# EAGLE design line_sensor_ver1.1 (EAGLE 6.2)
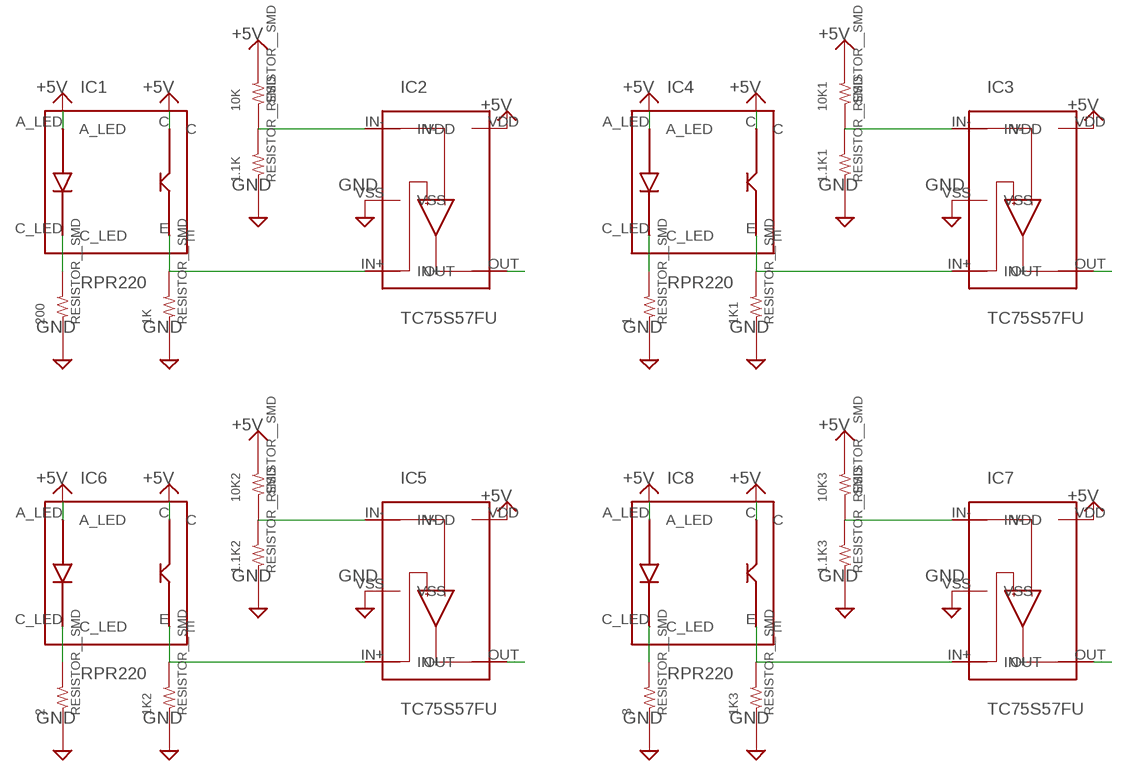
[diagram p0: schematic, sheet 1]

## Parts
1  RESISTOR__SMD  [1608]
1.1K  RESISTOR__SMD  [1608]
1.1K1  RESISTOR__SMD  [1608]
1.1K2  RESISTOR__SMD  [1608]
1.1K3  RESISTOR__SMD  [1608]
1K  RESISTOR__SMD  [1608]
1K1  RESISTOR__SMD  [1608]
1K2  RESISTOR__SMD  [1608]
1K3  RESISTOR__SMD  [1608]
2  RESISTOR__SMD  [1608]
3  RESISTOR__SMD  [1608]
10K  RESISTOR__SMD  [1608]
10K1  RESISTOR__SMD  [1608]
10K2  RESISTOR__SMD  [1608]
10K3  RESISTOR__SMD  [1608]
200  RESISTOR__SMD  [1608]
IC1  RPR220  [RPR220]
IC2  TC75S57FU  [SSOP5-P-0.65A]
IC3  TC75S57FU  [SSOP5-P-0.65A]
IC4  RPR220  [RPR220]
IC5  TC75S57FU  [SSOP5-P-0.65A]
IC6  RPR220  [RPR220]
IC7  TC75S57FU  [SSOP5-P-0.65A]
IC8  RPR220  [RPR220]

## Nets
+5V: 10K1.2 10K2.2 10K3.2 10K.2 IC1.A_LED IC1.C IC2.VDD IC3.VDD IC4.A_LED IC4.C IC5.VDD IC6.A_LED IC6.C IC7.VDD IC8.A_LED IC8.C
GND: 1.1 1.1K1.1 1.1K2.1 1.1K3.1 1.1K.1 1K1.1 1K2.1 1K3.1 1K.1 2.1 3.1 200.1 IC2.VSS IC3.VSS IC5.VSS IC7.VSS
N$1: 1.1K.2 10K.1 IC2.IN-
N$2: 1K.2 IC1.E IC2.IN+
N$3: 200.2 IC1.C_LED
N$4: 1.1K1.2 10K1.1 IC3.IN-
N$5: 1K1.2 IC3.IN+ IC4.E
N$6: 1.2 IC4.C_LED
N$7: 1.1K3.2 10K3.1 IC7.IN-
N$8: 1.1K2.2 10K2.1 IC5.IN-
N$9: 1K3.2 IC7.IN+ IC8.E
N$10: 1K2.2 IC5.IN+ IC6.E
N$11: 2.2 IC6.C_LED
N$12: 3.2 IC8.C_LED
OUT1: IC2.OUT
OUT2: IC3.OUT
OUT3: IC5.OUT
OUT4: IC7.OUT

## Library data of the parts
1 1.1K 1.1K1-1.1K3 1K 1K1-1K3 2 3 10K 10K1-10K3 200 = 01_R:RESISTOR__SMD
IC1 IC4 IC6 IC8 = 04_IC:RPR220
IC2 IC3 IC5 IC7 = 04_IC:TC75S57FU

## Board
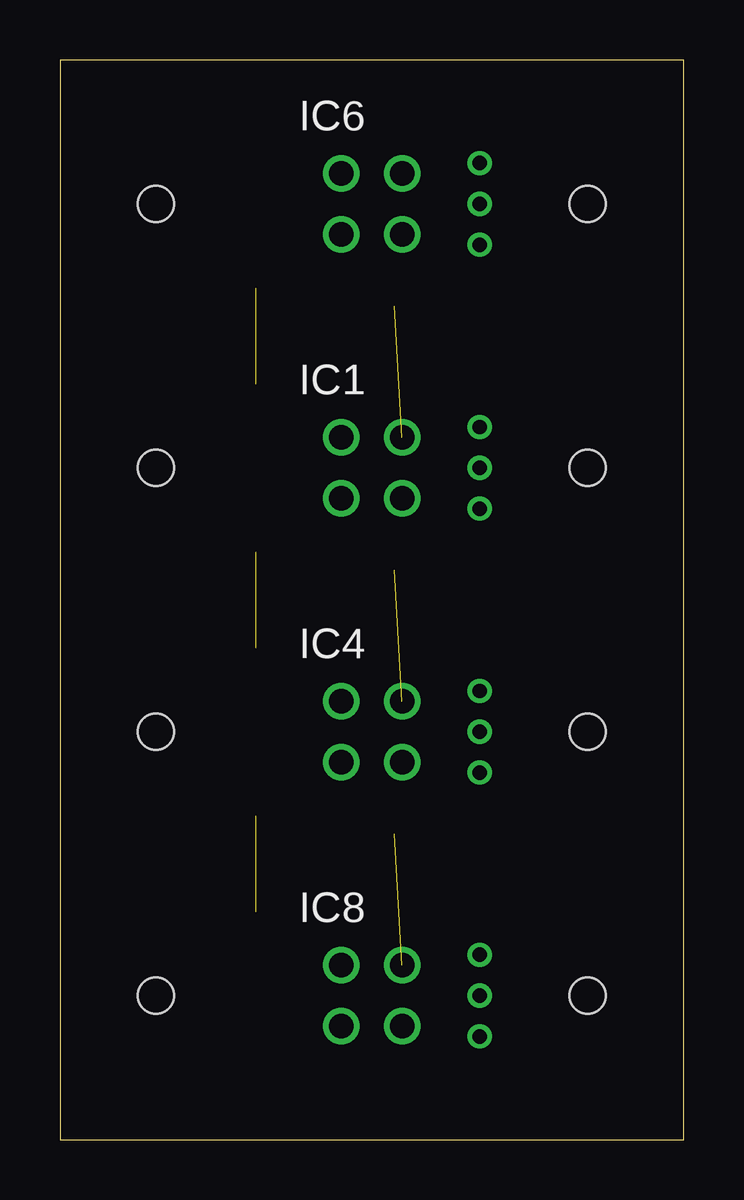
[diagram p1: board, top side]
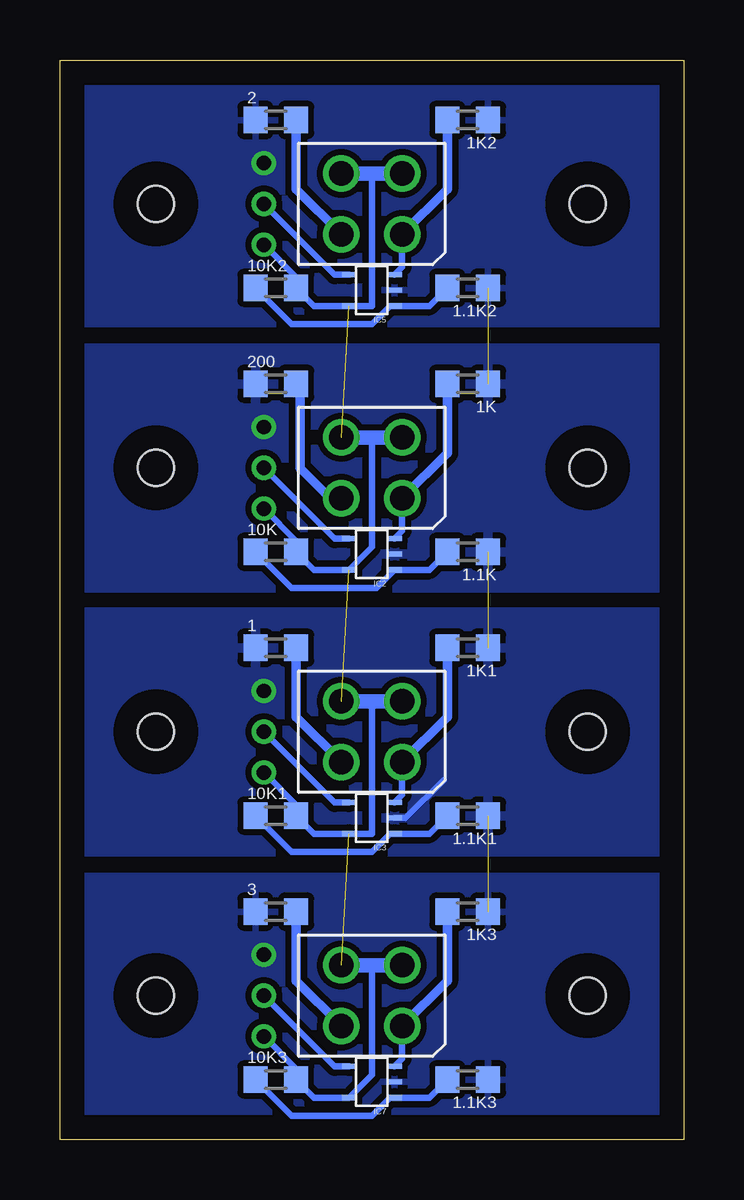
[diagram p2: board, bottom side, seen from below]

Size 26 x 45 mm. Coordinates in mm from the lower left corner, seen from the top.
Outline: 0,0 26,0 26,45 0,45 0,0
Copper layers (1*16): Top 0.035mm / dielectric 1.5mm / Bottom 0.035mm
Design rules: minimum track width 10mil, minimum drill 24mil, track to track 8mil, track to pad 8mil, pad to pad 8mil, via to via 8mil, smd to smd 8mil, copper to edge 40mil, drill to drill 8mil, minimum pad ring 10mil, minimum via ring 8mil, stop-mask expansion 4mil, vias tented up to drill 0mil, thermal gap 10mil
Holes 1.5 mm at 4,28 22,28 4,17 4,39 22,39 22,17 4,6 22,6

### Footprints (pad centres in the part's own frame; a part is rotated, then mirrored left to right if it is on the bottom)
1608 = smd 1 x 1.1: 1 -0.85,0; 2 0.85,0
RPR220 = drill 1.016: A_LED 1.27,1.27; C -1.27,1.27; C_LED 1.27,-1.27; E -1.27,-1.27
SSOP5-P-0.65A = smd 0.6 x 0.21: IN+ -0.95,-0.65; IN- -0.95,0.65; OUT 0.95,-0.65; VDD 0.95,0.65; VSS -0.95,0

### Placement (x,y rotation side)
1  17,20.5 0 bottom
1.1K  9,24.5 180 bottom
1.1K1  9,13.5 180 bottom
1.1K2  9,35.5 180 bottom
1.1K3  9,2.5 180 bottom
1K  9,31.5 180 bottom
1K1  9,20.5 180 bottom
1K2  9,42.5 180 bottom
1K3  9,9.5 180 bottom
2  17,42.5 0 bottom
3  17,9.5 0 bottom
10K  17,24.5 0 bottom
10K1  17,13.5 0 bottom
10K2  17,35.5 0 bottom
10K3  17,2.5 0 bottom
200  17,31.5 0 bottom
IC1  13,28 0 top
IC2  13,24.4 180 bottom
IC3  13,13.4 180 bottom
IC4  13,17 0 top
IC5  13,35.4 180 bottom
IC6  13,39 0 top
IC7  13,2.4 180 bottom
IC8  13,6 0 top

### Tracks (layer width: path | path; a pad name or v marks a point on that pad's centre or on a via)
+5V  (via drill 0.6)  (3 unrouted)
  Bottom 0.28: 13,29.27 13,24.7 IC2.VDD 15.4,23.75 10K.2 16.15,24.95 v17.5,26.3 | 13,18.27 13,12.75 IC3.VDD 15.4,12.75 10K1.2 16.15,13.95 v17.5,15.3 | 13,40.27 13,34.75 IC5.VDD 15.4,34.75 10K2.2 16.15,35.95 v17.5,37.3 | v17.5,4.3 16.15,2.95 10K3.2 15.4,1.75 IC7.VDD 13,2.7 13,7 13.27,7.27 IC8.A_LED
  Bottom 0.6: IC1.A_LED 13,29.27 IC1.C | IC4.A_LED 13,18.27 IC4.C | IC6.C 13,40.27 IC6.A_LED | IC8.C IC8.A_LED
GND  (via drill 0.6)  (3 unrouted)
  Bottom 0.28: IC3.VSS 11.6,13.4 10,15
  other vias: 17.5,29.7 17.5,40.7 17.5,18.7 17.5,7.7
  pour Bottom (isolate 0.254): 1,33 25,33 25,23 1,23
  pour Bottom (isolate 0.254): 1,12 25,12 25,22 1,22
  pour Bottom (isolate 0.254): 1,34 25,34 25,44 1,44
  pour Bottom (isolate 0.254): 1,11 25,11 25,1 1,1
N$1
  Bottom 0.28: 1.1K.2 10.6,23.75 IC2.IN- 12.8,23 16.35,23 10K.1
N$2
  Bottom 0.28: IC2.IN+ 11.73,25.37 IC1.E
  Bottom 0.4: IC1.E 9.85,28.61 1K.2
N$3
  Bottom 0.4: IC1.C_LED 14.73,26.73 16,28 16,31.35 200.2
N$4
  Bottom 0.28: 1.1K1.2 10.6,12.75 IC3.IN- 12.25,12.75 13,12 16.35,12 10K1.1
N$5
  Bottom 0.28: IC3.IN+ 11.73,14.37 IC4.E
  Bottom 0.4: IC4.E 9.85,17.61 1K1.2
N$6
  Bottom 0.4: IC4.C_LED 16.15,17.61 1.2
N$7
  Bottom 0.28: 10K3.1 16.35,1 13,1 12.25,1.75 IC7.IN- 10.6,1.75 1.1K3.2
N$8
  Bottom 0.28: 1.1K2.2 10.6,34.75 IC5.IN- 12.25,34.75 13,34 16.35,34 10K2.1
N$9
  Bottom 0.28: IC8.E 11.73,3.37 IC7.IN+
  Bottom 0.4: 1K3.2 9.85,6.61 IC8.E
N$10
  Bottom 0.28: IC5.IN+ 11.73,36.37 IC6.E
  Bottom 0.4: 1K2.2 9.85,39.61 IC6.E
N$11
  Bottom 0.4: 2.2 16.15,39.61 IC6.C_LED
N$12
  Bottom 0.4: 3.2 16.15,6.61 IC8.C_LED
OUT1  (via drill 0.6)
  Bottom 0.28: IC2.OUT 14.55,25.05 v17.5,28
  Bottom 0.4: v17.5,28 17.5,27.9
OUT2  (via drill 0.6)
  Bottom 0.28: IC3.OUT 14.55,14.05 v17.5,17
OUT3  (via drill 0.6)
  Bottom 0.28: IC5.OUT 14.55,36.05 v17.5,39
OUT4  (via drill 0.6)
  Bottom 0.28: IC7.OUT 14.55,3.05 v17.5,6